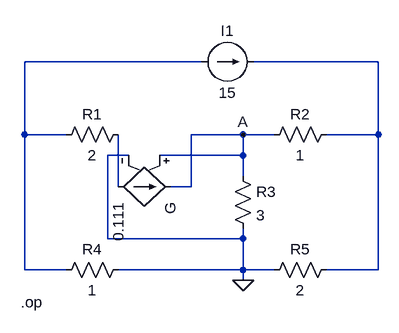
[diagram p0: schematic Draft32.asc]
Draft32.asc, the LTspice schematic file:
Version 4
SHEET 1 880 680
WIRE 256 48 -16 48
WIRE 528 48 336 48
WIRE -16 160 -16 48
WIRE 48 160 -16 160
WIRE 320 160 240 160
WIRE 368 160 320 160
WIRE 528 160 528 48
WIRE 528 160 448 160
WIRE 144 192 112 192
WIRE 320 192 320 160
WIRE 320 192 192 192
WIRE 320 224 320 192
WIRE 128 240 128 160
WIRE 240 240 240 160
WIRE 240 240 208 240
WIRE 112 320 112 192
WIRE 320 320 320 304
WIRE 320 320 112 320
WIRE -16 368 -16 160
WIRE 48 368 -16 368
WIRE 320 368 320 320
WIRE 320 368 128 368
WIRE 368 368 320 368
WIRE 528 368 528 160
WIRE 528 368 448 368
WIRE 320 384 320 368
FLAG 320 160 A
FLAG 320 384 0
SYMBOL res 144 144 R90
WINDOW 0 0 56 VBottom 2
WINDOW 3 32 56 VTop 2
SYMATTR InstName R1
SYMATTR Value 2
SYMBOL res 464 144 R90
WINDOW 0 0 56 VBottom 2
WINDOW 3 32 56 VTop 2
SYMATTR InstName R2
SYMATTR Value 1
SYMBOL res 304 208 R0
SYMATTR InstName R3
SYMATTR Value 3
SYMBOL res 144 352 R90
WINDOW 0 0 56 VBottom 2
WINDOW 3 32 56 VTop 2
SYMATTR InstName R4
SYMATTR Value 1
SYMBOL res 464 352 R90
WINDOW 0 0 56 VBottom 2
WINDOW 3 32 56 VTop 2
SYMATTR InstName R5
SYMATTR Value 2
SYMBOL current 256 48 R270
WINDOW 0 32 40 VTop 2
WINDOW 3 -32 40 VBottom 2
WINDOW 123 0 0 Left 0
WINDOW 39 0 0 Left 0
SYMATTR InstName I1
SYMATTR Value 15
SYMBOL g 224 240 R90
SYMATTR InstName G
SYMATTR Value 0.111
TEXT -22 418 Left 2 !.op

The netlist it stands for:
* Draft32.asc
R1 N003 N001 2
R2 N002 A 1
R3 A 0 3
R4 0 N001 1
R5 N002 0 2
I1 N001 N002 15
G N003 A A 0 0.111
.op
.backanno
.end